# Altium project board_adruno.PrjPcb
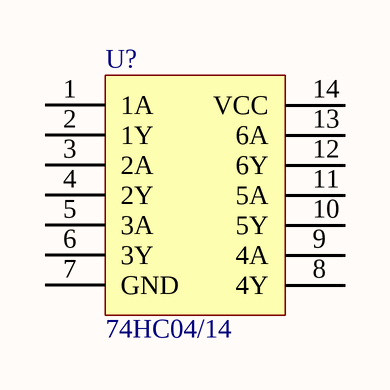
[diagram p0: Sheet1_adruno.SchDoc]
1 sheet, 1 parts. Net scope: global (net labels, ports and power ports of the same name join across sheets).
Board file: PCB1.PcbDoc

## Sheet Sheet1_adruno.SchDoc
size A; SheetNumber: 1; SheetTotal: 1

### Parts
U?  74HC04/14  [SOIC-14]

### Nets

Not connected (* = marked no-connect by the designer): U? 1(1A) 2(1Y) 3(2A) 4(2Y) 5(3A) 6(3Y) 7(GND) 8(4Y) 9(4A) 10(5Y) 11(5A) 12(6Y) 13(6A) 14(VCC)

### Library data of the parts
U? = 74HC04: Hex inverter